# EAGLE schematic Sensor Board Schematic (EAGLE 9.3.0)
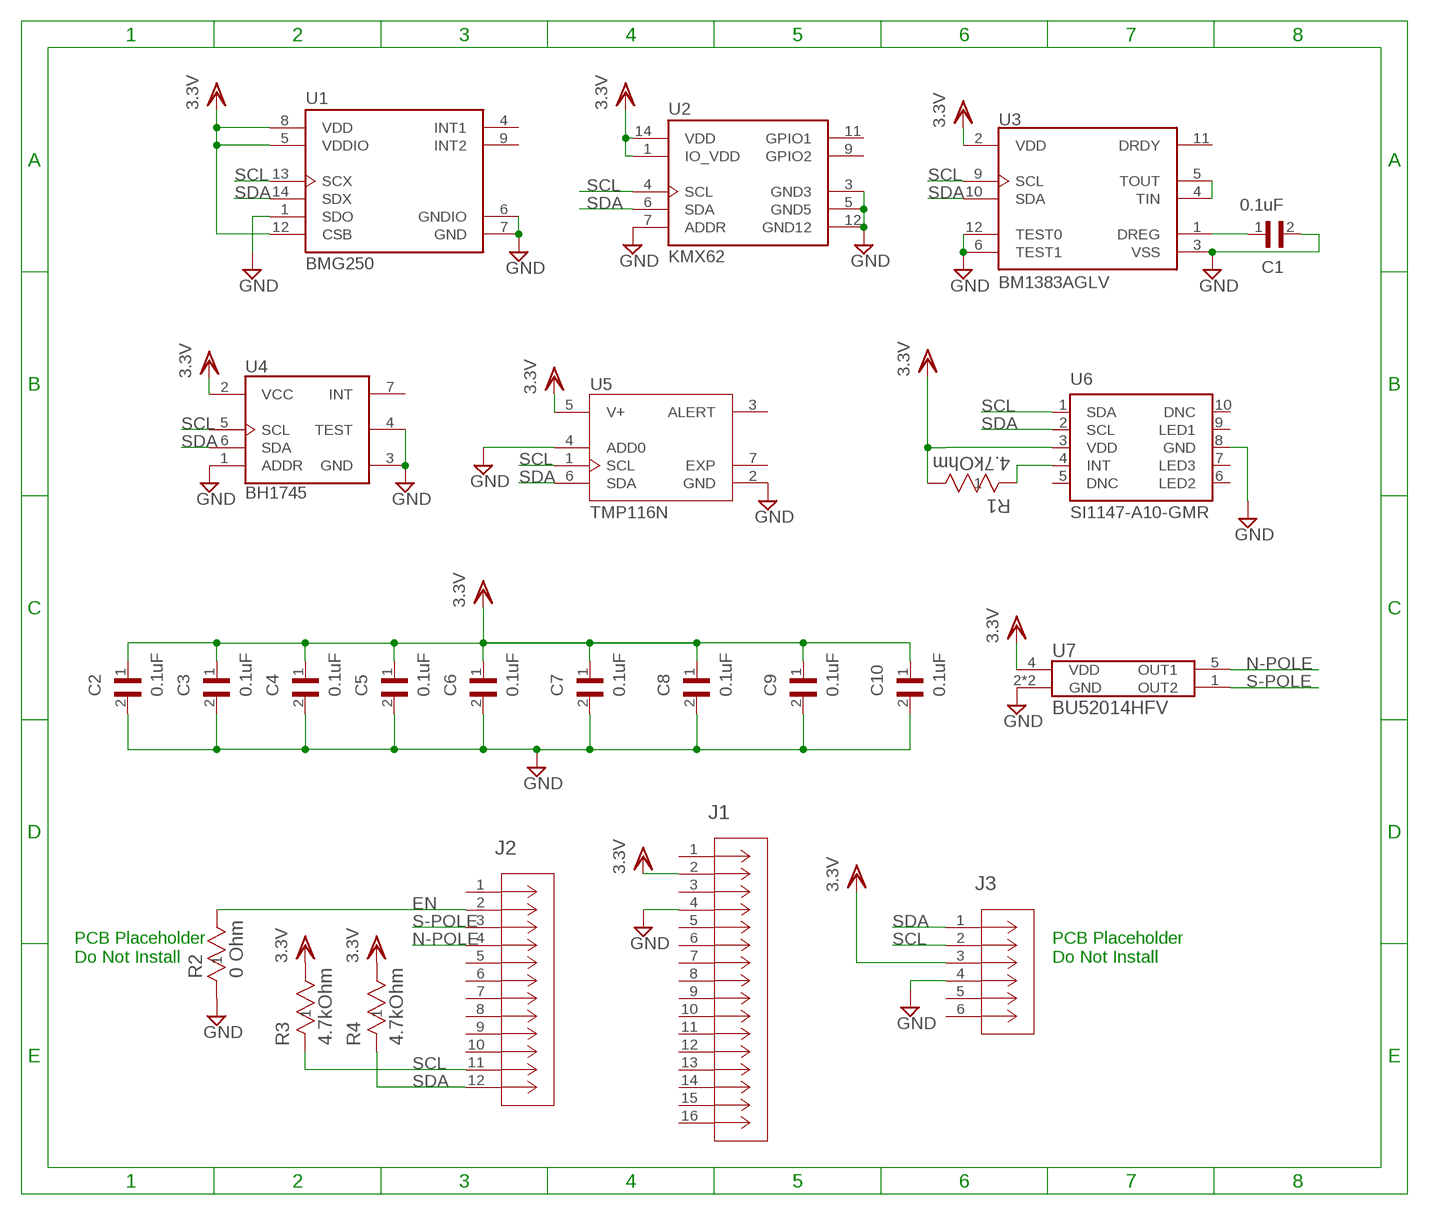
[diagram p0: schematic, sheet 1]

## Parts
C1  0.1uF  GRM033C80J104KE15D  [CAPC0603X33N]
C2  0.1uF  GRM033C80J104KE15D  [CAPC0603X33N]
C3  0.1uF  GRM033C80J104KE15D  [CAPC0603X33N]
C4  0.1uF  GRM033C80J104KE15D  [CAPC0603X33N]
C5  0.1uF  GRM033C80J104KE15D  [CAPC0603X33N]
C6  0.1uF  GRM033C80J104KE15D  [CAPC0603X33N]
C7  0.1uF  GRM033C80J104KE15D  [CAPC0603X33N]
C8  0.1uF  GRM033C80J104KE15D  [CAPC0603X33N]
C9  0.1uF  GRM033C80J104KE15D  [CAPC0603X33N]
C10  0.1uF  GRM033C80J104KE15D  [CAPC0603X33N]
J1  SSQ-116-03-T-S  [CON16_1X16_TU_SSQ]
J2  SSQ-112-03-T-S  [CON12_1X12_TU_SSQ]
J3  SSQ-106-03-T-S  [CON6_1X6_TU_SSQ]
R1  4.7kOhm  RMCF0402JT4K70  [STA_RMCF0402]
R2  0 Ohm  RMCF0402ZT0R00  [STA_RMCF0402]
R3  4.7kOhm  RMCF0402JT4K70  [STA_RMCF0402]
R4  4.7kOhm  RMCF0402JT4K70  [STA_RMCF0402]
U1  BMG250  [BMG250FP]
U2  KMX62  [LGA-16-3X2.5]
U3  BM1383AGLV-ZE2  [PQFN55P250X250X100-12N]
U4  BH1745  [BH1745]
U5  TMP116NAIDRVR  [SON65P200X200X80-7N]
U6  SI1147-A10-GMR  [QFN10-2X2]
U7  BU52014HFV  [SOP50P160X60-5N]

## Nets
EN: J2.2 R2.2
GND: C1.2 C2.2 C3.2 C4.2 C5.2 C6.2 C7.2 C8.2 C9.2 C10.2 J1.4 J3.4 R2.1 U1.1(SDO) U1.6(GNDIO) U1.7(GND) U2.3(GND3) U2.5(GND5) U2.7(ADDR) U2.12(GND12) U3.3(VSS) U3.6(TEST1) U3.12(TEST0) U4.1(ADDR) U4.3(GND) U4.4(TEST) U5.2(GND) U5.4(ADD0) U6.8(GND) U7.2(GND) U7.2.2(GND)
N$1: C1.1 U3.1(DREG)
N$2: U3.4(TIN) U3.5(TOUT)
N$3: R1.1 U6.4(INT)
N-POLE: J2.4 U7.5(OUT1)
S-POLE: J2.3 U7.1(OUT2)
SCL: J2.11 J3.2 R3.1 U1.13(SCX) U2.4(SCL) U3.9(SCL) U4.5(SCL) U5.1(SCL) U6.1(SDA)
SDA: J2.12 J3.1 R4.1 U1.14(SDX) U2.6(SDA) U3.10(SDA) U4.6(SDA) U5.6(SDA) U6.2(SCL)
VDD: C2.1 C3.1 C4.1 C5.1 C6.1 C7.1 C8.1 C9.1 C10.1 J1.2 J3.3 R1.2 R3.2 R4.2 U1.5(VDDIO) U1.8(VDD) U1.12(CSB) U2.1(IO_VDD) U2.14(VDD) U3.2(VDD) U4.2(VCC) U5.5(V+) U6.3(VDD) U7.4(VDD) ; supply symbol labelled 3.3V
Unconnected: J1.1 J1.3 J1.5 J1.6 J1.7 J1.8 J1.9 J1.10 J1.11 J1.12 J1.13 J1.14 J1.15 J1.16 J2.1 J2.5 J2.6 J2.7 J2.8 J2.9 J2.10 J3.5 J3.6 U1.4(INT1) U1.9(INT2) U2.9(GPIO2) U2.11(GPIO1) U3.11(DRDY) U4.7(INT) U5.3(ALERT) U6.5(DNC) U6.6(LED2) U6.7(LED3) U6.9(LED1) U6.10(DNC)

## Notes on the sheet
- PCB Placeholder
  Do Not Install
- PCB Placeholder
  Do Not Install

## Power pins joined to a net without a drawn wire
EXP: U5.7(EXP)

## Library data of the parts
C1-C10 = GRM033C80J104KE15D:GRM033C80J104KE15D: .1UF 6.3V 10% 0201; DESCRIPTION: 0201 0.1 uF 6.3 V ±10% Tolerance X6S Multilayer Ceramic Capacitor; DIGI-KEY_PART_NUMBER: 490-10390-1-ND; DIGI-KEY_PURCHASE_URL: https://www.digikey.com/product-detail/en/murata-electronics-north-america/GRM033C80J104KE15D/490-10390-1-ND/5026263?utm_source=snapeda&utm_medium=aggregator&utm_campaign=symbol; MF: Murata Electronics; MP: GRM033C80J104KE15D; PACKAGE: 0201 Murata
J1 = SSQ-116-03-T-S:SSQ-116-03-T-S; MANUFACTURER_PART_NUMBER: SSQ11603TS; VENDOR: Samtec Inc
J2 = SSQ-112-03-T-S:SSQ-112-03-T-S; MANUFACTURER_PART_NUMBER: SSQ11203TS; VENDOR: Samtec Inc
J3 = SSQ-106-03-T-S:SSQ-106-03-T-S; MANUFACTURER_PART_NUMBER: SSQ10603TS; VENDOR: Samtec Inc
R1 R3 R4 = RMCF0402JT4K70:RMCF0402JT4K70; MANUFACTURER_PART_NUMBER: RMCF0402JT4K70; VENDOR: Stackpole International
R2 = RMCF0402ZT0R00:RMCF0402ZT0R00; MANUFACTURER_PART_NUMBER: RMCF0402ZT0R00; VENDOR: Stackpole International
U1 = BMG250:BMG250: BMG250 3-Axis Gyroscope
U2 = KMX62:KMX62
U3 = BM1383AGLV-ZE2:BM1383AGLV-ZE2: Pressure Sensor 30kPa to 110kPa 12-Pin CLGA T/R; DESCRIPTION: Pressure Sensor 30kPa to 110kPa 12-Pin CLGA T/R; DIGI-KEY_PART_NUMBER: BM1383AGLV-ZE2CT-ND; DIGI-KEY_PURCHASE_URL: https://www.digikey.com/product-detail/en/rohm-semiconductor/BM1383AGLV-ZE2/BM1383AGLV-ZE2CT-ND/6193303?utm_source=snapeda&utm_medium=aggregator&utm_campaign=symbol; MF: Rohm; MP: BM1383AGLV-ZE2; PACKAGE: VFLGA-12 Rohm
U4 = BH1745:BH1745
U5 = TMP116NAIDRVR:TMP116NAIDRVR: TEMPERATURE SENSOR; DESCRIPTION: High-Accuracy, Low-Power Digital Temperature Sensor 6-WSON -55 to 150; DIGI-KEY_PART_NUMBER: 296-48306-1-ND; DIGI-KEY_PURCHASE_URL: https://www.digikey.com/product-detail/en/texas-instruments/TMP116NAIDRVR/296-48306-1-ND/8347725?utm_source=snapeda&utm_medium=aggregator&utm_campaign=symbol; MF: Texas Instruments; MP: TMP116NAIDRVR; PACKAGE: WDFN-6 Texas Instruments
U6 = si11xx_10:SI1147-*: Proximity/UV/Ambient Light Sensor IC with I2C Interface Source: http://www.silabs.com/Support%20Documents/TechnicalDocs/Si1145-46-47.pdf; MF: Silicon Labs; MPN: Si1147-A10-GMR; OC_FARNELL: unknown; OC_NEWARK: unknown
U7 = BU52014HFV:BU52014HFV: Omnipolar Detection Hall ICs (Polarity detection for both S and N features dual outputs); DESCRIPTION: BU52014HFV Series 3.3 V ± 0.5 mA SMT Omnipolar Detection Hall IC - HVSOF-5; DIGI-KEY_PART_NUMBER: BU52014HFVCT-ND; DIGI-KEY_PURCHASE_URL: https://www.digikey.com/product-detail/en/rohm-semiconductor/BU52014HFV-TR/BU52014HFVCT-ND/1679727?utm_source=snapeda&utm_medium=aggregator&utm_campaign=symbol; MF: Rohm; MP: BU52014HFV-TR; PACKAGE: SOT-665 Rohm